# Altium project mobile Basisstation.PrjPcb
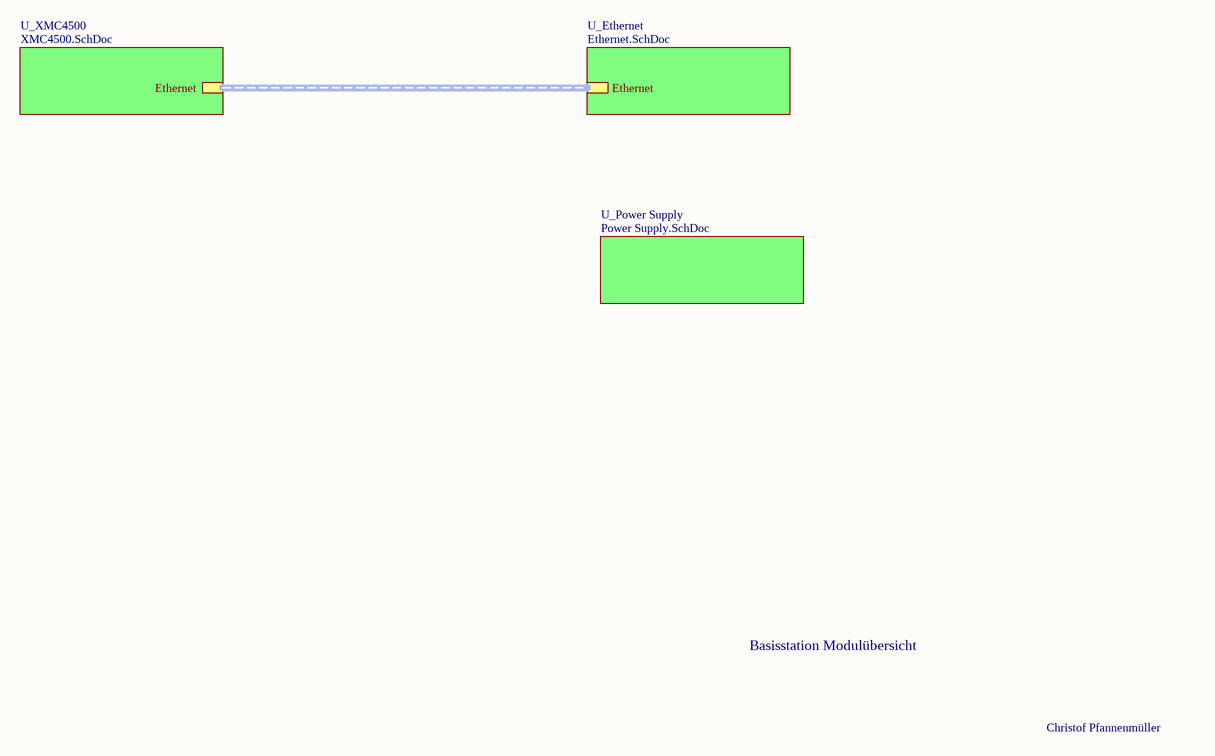
[diagram p0: Basisstation.SchDoc]
5 sheets, 215 parts. Net scope: hierarchical (ports join the sheet entries above them; power ports are global).
Board file: PCB_Testplatine.PcbDoc
Sheets:
  Basisstation.SchDoc
    U_Power Supply = Power Supply.SchDoc
    U_XMC4500 = XMC4500.SchDoc
      TDA1 = TDA5340.SchDoc
      TDA2 = TDA5340.SchDoc
      TDA3 = TDA5340.SchDoc
      TDA4 = TDA5340.SchDoc
      TDA5 = TDA5340.SchDoc
      TDA6 = TDA5340.SchDoc
    U_Ethernet = Ethernet.SchDoc

## Sheet Basisstation.SchDoc
size A4

### Sub-sheets
U_Ethernet = Ethernet.SchDoc: Ethernet (harness Ethernet)
U_Power Supply = Power Supply.SchDoc: no entries
U_XMC4500 = XMC4500.SchDoc: Ethernet (harness Ethernet)

### Buses and harness runs
harness sheet U_Ethernet/Ethernet = sheet U_XMC4500/Ethernet

### Notes on the sheet
- Basisstation Modulübersicht
- Christof Pfannenmüller

## Sheet Power Supply.SchDoc
size A4
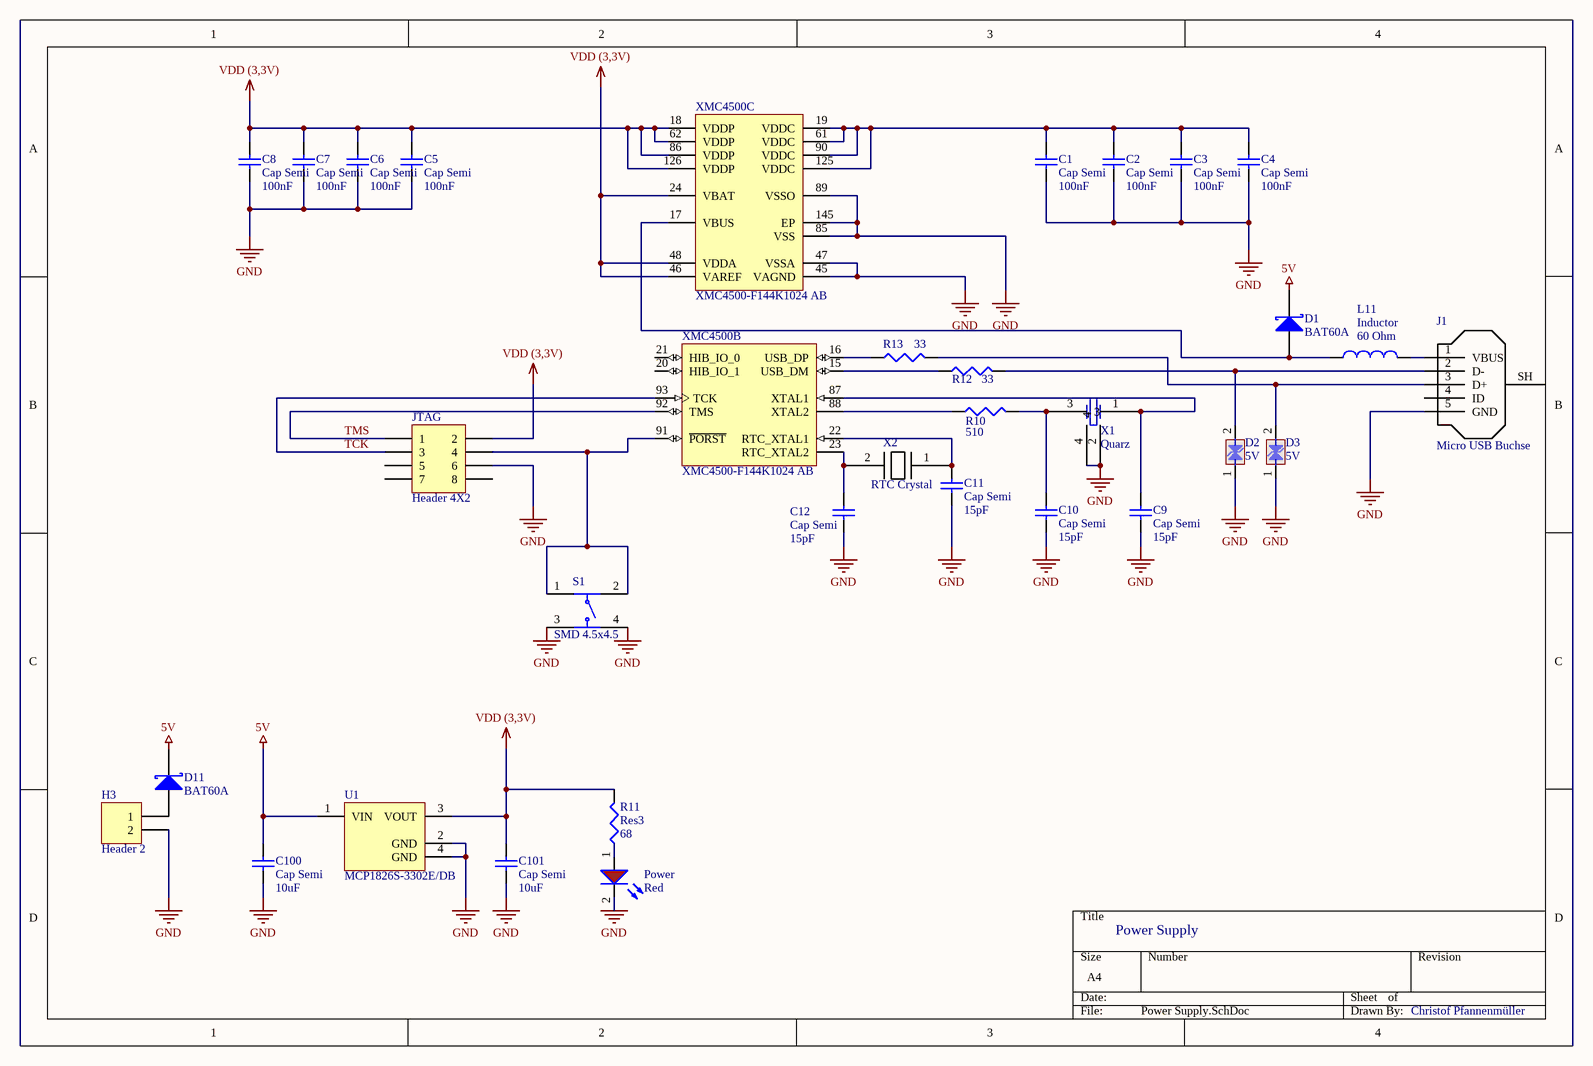
[diagram p1: Power Supply.SchDoc]

### Parts
C1  Cap Semi  value 100nF  [0402]
C2  Cap Semi  value 100nF  [0402]
C3  Cap Semi  value 100nF  [0402]
C4  Cap Semi  value 100nF  [0402]
C5  Cap Semi  value 100nF  [0402]
C6  Cap Semi  value 100nF  [0402]
C7  Cap Semi  value 100nF  [0402]
C8  Cap Semi  value 100nF  [0402]
C9  Cap Semi  value 15pF  [0402]
C10  Cap Semi  value 15pF  [0402]
C11  Cap Semi  value 15pF  [0402]
C12  Cap Semi  value 15pF  [0402]
C100  Cap Semi  value 10uF  [C1206]
C101  Cap Semi  value 10uF  [C1206]
D1  BAT60A  [SOD-323]
D2  5V  [WE-VE_0603]
D3  5V  [WE-VE_0603]
D11  BAT60A  [SOD-323]
H3  Header 2  [HDR1X2]
J1  Micro USB Buchse  [Micro USB Buchse - Molex]
JTAG  Header 4X2  [HDR2X4]
L11  Inductor  value 60 Ohm  [0603]
Power  Red  [LED_0805_Red]
R10  value 510  [J1-0603]  (hidden comment: Res3)
R11  Res3  value 68  [J1-0603]
R12  value 33  [J1-0603]  (hidden comment: Res3)
R13  value 33  [J1-0603]  (hidden comment: Res3)
S1  SMD 4.5x4.5  [430181038816]
U1  MCP1826S-3302E/DB  [SOT-223-DB3_N]
X1  Quarz  [Quarz]
X2  RTC Crystal  [RTC Uhrenquarz  1.5x3.2 SMD]
XMC4500  XMC4500-F144K1024 AB  [INF-PG-LQFP-144-18-6500X6500TP_N]  (parts B,C of 3)

### Nets
5V: C100.2 D1.1(K) D11.1(K) U1.1(VIN)
GND: C1.1 C2.1 C3.1 C4.1 C5.1 C6.1 C7.1 C8.1 C9.1 C10.1 C11.1 C12.1 C100.1 C101.1 D2.1(I/O1) D3.1(I/O1) H3.2 J1.5(GND) JTAG.6 Power.2(C) S1.3 S1.4 U1.2(GND) U1.4(GND) X1.2 X1.4 XMC4500.45(VAGND) XMC4500.47(VSSA) XMC4500.85(VSS) XMC4500.89(VSSO) XMC4500.145(EP)
VDD (3,3V): C5.2 C6.2 C7.2 C8.2 C101.2 JTAG.2 R11.2 U1.3(VOUT) XMC4500.18(VDDP) XMC4500.24(VBAT) XMC4500.46(VAREF) XMC4500.48(VDDA) XMC4500.62(VDDP) XMC4500.86(VDDP) XMC4500.126(VDDP)
TCK: JTAG.3 XMC4500.93(TCK)
TMS: JTAG.1 XMC4500.92(TMS)
NetC1_2: C1.2 C2.2 C3.2 C4.2 XMC4500.19(VDDC) XMC4500.61(VDDC) XMC4500.90(VDDC) XMC4500.125(VDDC)
NetC9_2: C9.2 X1.1 XMC4500.87(XTAL1)
NetC10_2: C10.2 R10.2 X1.3
NetC11_2: C11.2 X2.1 XMC4500.22(RTC_XTAL1)
NetC12_2: C12.2 X2.2 XMC4500.23(RTC_XTAL2)
NetD1_2: D1.2(A) L11.1 XMC4500.17(VBUS)
NetD2_2: D2.2(I/O2) J1.2(D-) R12.2
NetD3_2: D3.2(I/O2) J1.3(D+) R13.2
NetD11_2: D11.2(A) H3.1
NetJ1_1: J1.1(VBUS) L11.2
NetJTAG_4: JTAG.4 S1.1 S1.2 XMC4500.91(~{PORST})
NetPower_1: Power.1(A) R11.1
NetR10_1: R10.1 XMC4500.88(XTAL2)
NetR12_1: R12.1 XMC4500.15(USB_DM)
NetR13_1: R13.1 XMC4500.16(USB_DP)

Not connected (* = marked no-connect by the designer): J1 4(ID) SH; JTAG 5 7 8; XMC4500 20(HIB_IO_1) 21(HIB_IO_0)

### Notes on the sheet
- Power Supply
- Christof Pfannenmüller

### Library data of the parts
C1-C12 C100 C101 = Cap Semi: Capacitor (Semiconductor SIM Model); Published: 8-Jun-2000; LatestRevisionDate: 29-May-2009; LatestRevisionNote: IPC-7351 Footprint Added.; Publisher: Altium Limited; PackageDescription: Chip Capacitor
  C1-C12: PackageReference: C0402
  C100 C101: PackageReference: C1206
D1 D11 = BAT60A: Silicon AF Schottky Rectifier Diode with Extreme Low VF Drop; Published: 21-Mar-2003; LatestRevisionDate: 19-Mar-2004; LatestRevisionNote: Silkscreen size reduced.; DatasheetDocument: Jan-1999; PackageDocument: Sep-2000; PackageReference: SOD-323; Publisher: Altium Limited; ComponentLink1Description: Manufacturer Link; ComponentLink1URL: http://www.infineon.com/; ComponentLink2Description: Datasheet; ComponentLink2URL: http://www.infineon.com/upload/Document/cmc_upload/documents/081/715/bat60aseries_1.pdf
D2 D3 = WE-VE 0603, 82356050560: WE-VE ESD Suppressor, 0603, VDC=5V; Manufacturer: Wurth Elektronik; VDC: 5V; PartNo: 82356050560; ComponentLink1Description: Manufacturer; ComponentLink1URL: http://www.we-online.de; Created by: BJ.Chen; Created Date: Jan 2016; ComponentLink2Description: Datasheet; ComponentLink2URL: http://katalog.we-online.de/pbs/datasheet/82356050560.pdf
H3 = Header 2: Header, 2-Pin; LatestRevisionDate: 17-Jul-2002; LatestRevisionNote: Re-released for DXP Platform.; Publisher: Altium Limited
J1 = Micro USB Buchse - Molex
JTAG = Header 4X2: Header, 4-Pin, Dual row; LatestRevisionDate: 17-Jul-2002; LatestRevisionNote: Re-released for DXP Platform.; Publisher: Altium Limited
L11 = Inductor: Code_IEC: 1005; Published: 8-Jun-2000; LatestRevisionDate: 29-May-2009; LatestRevisionNote: IPC-7351 Footprint Added.; PackageReference: 0402-A; Publisher: Altium Limited; PackageDescription: Chip Inductor; Code_JEITA: 0402
Power = WL-SMCW 0805  150080RS75000: SMD mono-color Chip LED, WL-SMCW, Red; Manufacturer: W黵th Elektronik eiSos GmbH; PartNo: 150080RS75000; ComponentLink1Description: Manufacturer; ComponentLink1URL: http://www.we-online.de; Created by: Christin Otto; Created Date: June 2013; ComponentLink2Description: Datasheet; ComponentLink2URL: http://katalog.we-online.com/led/datasheet/150080RS75000.pdf; Color: Red
R10-R13 = Res3: Resistor; Published: 8-Jun-2000; LatestRevisionDate: 29-May-2009; LatestRevisionNote: IPC-7351 Footprint Added.; PackageReference: J1-0603; Publisher: Altium Limited; PackageDescription: Chip Resistor
S1 = WS-TASV, 430181038816: WS-TASV 4.5x4.5 mm SMD; Manufacturer: Wurth Elektronik; partNo: 430181038816; ComponentLink1Description: Manufacturer; ComponentLink1URL: http://www.we-online.de; Created by: Baojun Chen; Created Date: Dec.2015; ComponentLink2Description: Datasheet; ComponentLink2URL: http://katalog.we-online.de/em/datasheet/430181038816.pdf; Ausführung: SMD 4.5x4.5
U1 = MCP1826S-3302E/DB: 1000 mA, Low Voltage, Low Quiescent Current LDO Regulator, 3-Pin SOT-223, Extended Temperature; Manufacturer: Microchip; DatasheetVersion: revA, Aug-2007; PackageVersion: revBB, Aug-2009; PackageReference: SOT-223-DB3; PackageDescription: 3-Lead Plastic Small Outline Transistor (DB) [SOT-223]; Supplier 1: Digi-Key; Supplier Part Number 1: MCP1826S-3302E/DB-ND; Supplier 2: Newark; Supplier Part Number 2: 27M0037; Supplier 3: Mouser; Supplier Part Number 3: 579-MCP1826S-3302EDB; Mounting Technology: Surface Mount; PartNumber: MCP1826S-3302E/DB; ComponentLink1Description: Manufacturer URL; ComponentLink1URL: http://www.microchip.com/; ComponentLink2Description: Datasheet; ComponentLink2URL: http://ww1.microchip.com/downloads/en/DeviceDoc/22057a.pdf; ComponentLink3Description: Package Specification; ComponentLink3URL: http://www.microchip.com/stellent/groups/techpub_sg/documents/packagingspec/en012702.pdf
XMC4500 = XMC4500-F144K1024 AB: 120 MHz XMC4500 MCU with 1,024 KByte Program Memory, 160 KByte SRAM, 3.3 V, -40 to 125 degC, PG-LQFP-144, Green; Manufacturer: Infineon; A / D input lines (incl. FADC): 26; Digital I/O Lines: 91; Program Memory: 1,024.0 KByte; SRAM (incl. Cache): 160.0 KByte; Type of Serial I/O Interfaces: 6xSPI, Dual SPI, Quad SPI, UART, LIN, IIC, IIS; DatasheetVersion: V1.0; PackageVersion: V1.0; PackageReference: PG-LQFP-144-18; PackageDescription: 144-Pin Plastic (Green) Low Profile Quad Flat Package, 20 x 20 mm Body, 0.5 mm Pitch; Halogen-free: TRUE; Mounting Technology: Surface Mount; PartNumber: XMC4500-F144K1024 AB; ComponentLink1Description: Manufacturer URL; ComponentLink1URL: http://www.infineon.com; ComponentLink2Description: Datasheet; ComponentLink2URL: http://www.infineon.com/dgdl/xmc4500_ds_v1+0_2013_01.pdf?folderId=db3a30433580b3710135a47f3eb76c98&fileId=db3a304335b504400135bdca7ed86742&location=en.Products.Microcontrollers.32-bit_Industrial_Microcontrollers_based_on_ARM__Cortex_-M.32-bit_XMC4000_Industrial_Microcontrollers_ARM__Cortex_-M4.DATASHEET.xmc4500_ds_v1 0_2013_01.pdf; ComponentLink3Description: Package Specification; ComponentLink3URL: http://www.infineon.com/cms/packages/SMD_-_Surface_Mounted_Devices/P-PG-LQFP/P-PG-LQFP-144-04x_13x_14x_15x_16x_18.html?__locale=en

## Sheet XMC4500.SchDoc
size A4
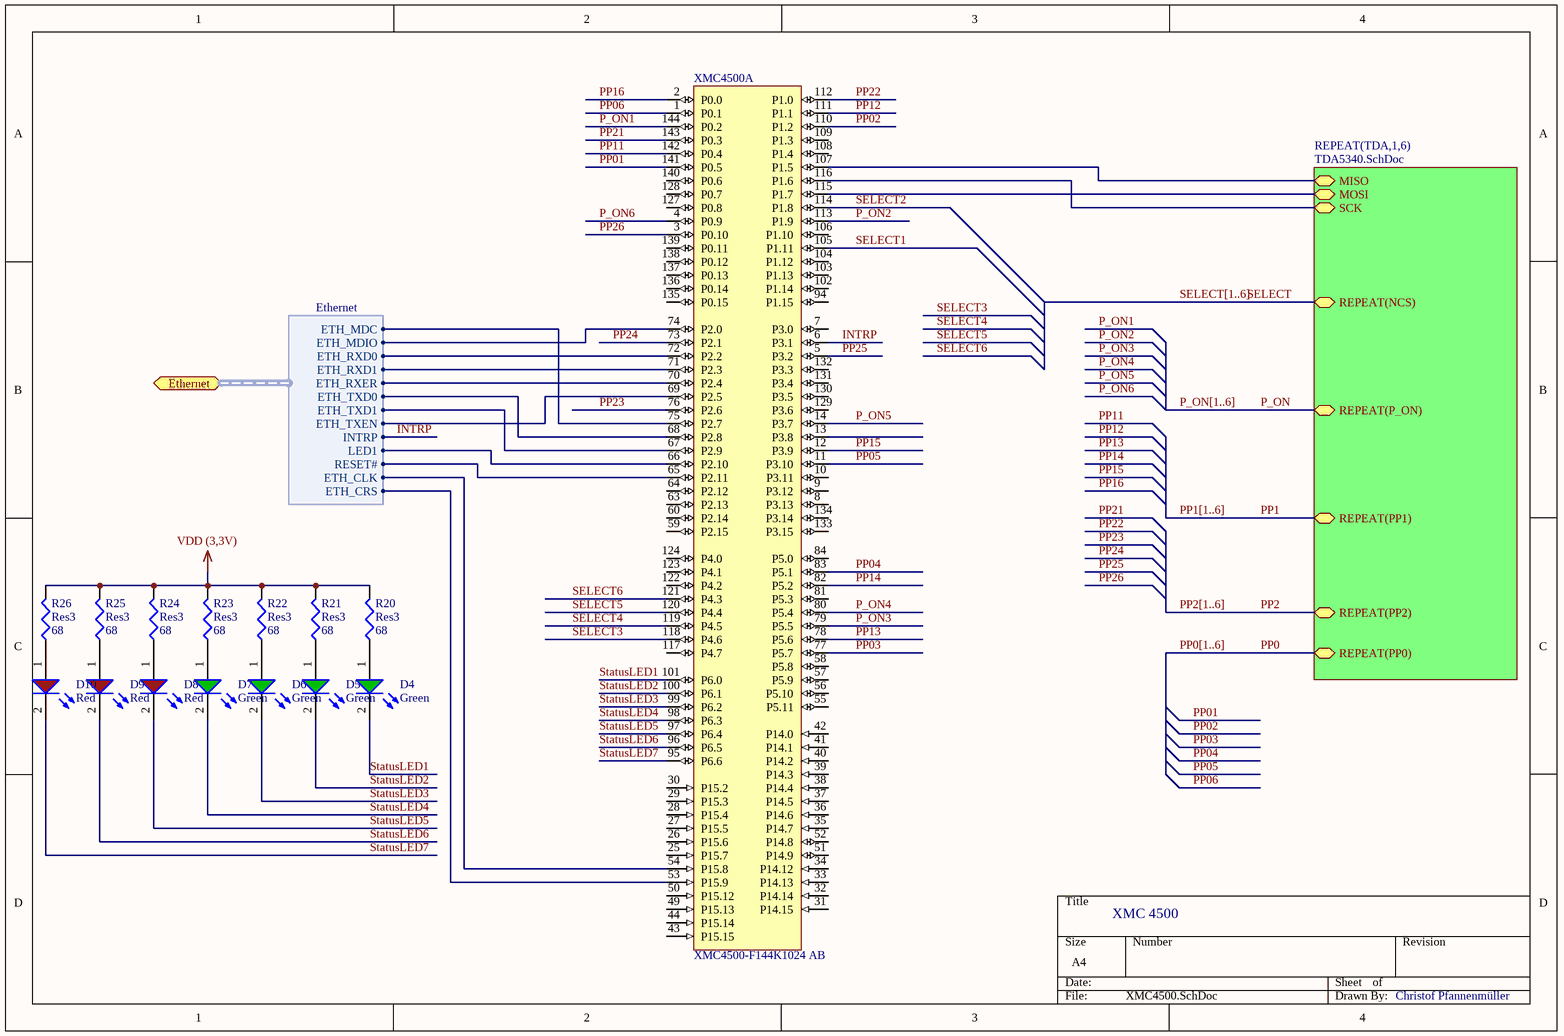
[diagram p2: XMC4500.SchDoc]

### Parts
D4  Green  [LED_0805_Green]
D5  Green  [LED_0805_Green]
D6  Green  [LED_0805_Green]
D7  Green  [LED_0805_Green]
D8  Red  [LED_0805_Red]
D9  Red  [LED_0805_Red]
D10  Red  [LED_0805_Red]
R20  Res3  value 68  [J1-0603]
R21  Res3  value 68  [J1-0603]
R22  Res3  value 68  [J1-0603]
R23  Res3  value 68  [J1-0603]
R24  Res3  value 68  [J1-0603]
R25  Res3  value 68  [J1-0603]
R26  Res3  value 68  [J1-0603]
XMC4500  XMC4500-F144K1024 AB  [INF-PG-LQFP-144-18-6500X6500TP_N]  (part A of 3)

### Sub-sheets
REPEAT(TDA,1,6) = TDA5340.SchDoc: MISO, MOSI, REPEAT(NCS), REPEAT(P_ON), REPEAT(PP2), SCK, REPEAT(PP0), REPEAT(PP1)

### Ports
Ethernet (harness Ethernet)

### Harnesses
Ethernet: ETH_CLK, ETH_CRS, ETH_MDC, ETH_MDIO, ETH_RXD0, ETH_RXD1, ETH_RXER, ETH_TXD0, ETH_TXD1, ETH_TXEN, INTRP, LED1, RESET#

### Nets
VDD (3,3V): R20.2 R21.2 R22.2 R23.2 R24.2 R25.2 R26.2
INTRP: XMC4500.6(P3.1) ; port Ethernet.INTRP
LED1: XMC4500.66(P2.10) ; port Ethernet.LED1
MISO: XMC4500.107(P1.5) ; sheet REPEAT(TDA,1,6)/MISO
MOSI: XMC4500.115(P1.7) ; sheet REPEAT(TDA,1,6)/MOSI
P_ON: sheet REPEAT(TDA,1,6)/REPEAT(P_ON)
P_ON1: XMC4500.144(P0.2)  [project net P_ON]
P_ON2: XMC4500.113(P1.9)  [project net P_ON]
P_ON3: XMC4500.79(P5.5)  [project net P_ON]
P_ON4: XMC4500.80(P5.4)  [project net P_ON]
P_ON5: XMC4500.14(P3.7)  [project net P_ON]
P_ON6: XMC4500.4(P0.9)  [project net P_ON]
PP0: sheet REPEAT(TDA,1,6)/REPEAT(PP0)
PP01: XMC4500.141(P0.5)  [project net PP0]
PP1: sheet REPEAT(TDA,1,6)/REPEAT(PP1)
PP02: XMC4500.110(P1.2)  [project net PP0]
PP2: sheet REPEAT(TDA,1,6)/REPEAT(PP2)
PP03: XMC4500.77(P5.7)  [project net PP0]
PP04: XMC4500.83(P5.1)  [project net PP0]
PP05: XMC4500.11(P3.10)  [project net PP0]
PP06: XMC4500.1(P0.1)  [project net PP0]
PP11: XMC4500.142(P0.4)  [project net PP1]
PP12: XMC4500.111(P1.1)  [project net PP1]
PP13: XMC4500.78(P5.6)  [project net PP1]
PP14: XMC4500.82(P5.2)  [project net PP1]
PP15: XMC4500.12(P3.9)  [project net PP1]
PP16: XMC4500.2(P0.0)  [project net PP1]
PP21: XMC4500.143(P0.3)  [project net PP2]
PP22: XMC4500.112(P1.0)  [project net PP2]
PP23: XMC4500.76(P2.6)  [project net PP2]
PP24: XMC4500.73(P2.1)  [project net PP2]
PP25: XMC4500.5(P3.2)  [project net PP2]
PP26: XMC4500.3(P0.10)  [project net PP2]
RESET#: XMC4500.65(P2.11) ; port Ethernet.RESET#
SCK: XMC4500.116(P1.6) ; sheet REPEAT(TDA,1,6)/SCK
SELECT: sheet REPEAT(TDA,1,6)/REPEAT(NCS)
SELECT1: XMC4500.105(P1.11)  [project net NCS]
SELECT2: XMC4500.114(P1.8)  [project net NCS]
SELECT3: XMC4500.118(P4.6)  [project net NCS]
SELECT4: XMC4500.119(P4.5)  [project net NCS]
SELECT5: XMC4500.120(P4.4)  [project net NCS]
SELECT6: XMC4500.121(P4.3)  [project net NCS]
StatusLED1: D4.2(C) XMC4500.101(P6.0)
StatusLED2: D5.2(C) XMC4500.100(P6.1)
StatusLED3: D6.2(C) XMC4500.99(P6.2)
StatusLED4: D7.2(C) XMC4500.98(P6.3)
StatusLED5: D8.2(C) XMC4500.97(P6.4)
StatusLED6: D9.2(C) XMC4500.96(P6.5)
StatusLED7: D10.2(C) XMC4500.95(P6.6)
NetD4_1: D4.1(A) R20.1
NetD5_1: D5.1(A) R21.1
NetD6_1: D6.1(A) R22.1
NetD7_1: D7.1(A) R23.1
NetD8_1: D8.1(A) R24.1
NetD9_1: D9.1(A) R25.1
NetD10_1: D10.1(A) R26.1
NetIC3_10: XMC4500.74(P2.0) ; port Ethernet.ETH_MDIO
NetIC3_11: XMC4500.75(P2.7) ; port Ethernet.ETH_MDC
NetIC3_12: XMC4500.71(P2.3) ; port Ethernet.ETH_RXD1
NetIC3_13: XMC4500.72(P2.2) ; port Ethernet.ETH_RXD0
NetIC3_15: XMC4500.53(P15.9) ; port Ethernet.ETH_CRS
NetIC3_16: XMC4500.54(P15.8) ; port Ethernet.ETH_CLK
NetIC3_17: XMC4500.70(P2.4) ; port Ethernet.ETH_RXER
NetIC3_19: XMC4500.69(P2.5) ; port Ethernet.ETH_TXEN
NetIC3_20: XMC4500.68(P2.8) ; port Ethernet.ETH_TXD0
NetIC3_21: XMC4500.67(P2.9) ; port Ethernet.ETH_TXD1

Not connected (* = marked no-connect by the designer): XMC4500 7(P3.0) 8(P3.13) 9(P3.12) 10(P3.11) 13(P3.8) 25(P15.7) 26(P15.6) 27(P15.5) 28(P15.4) 29(P15.3) 30(P15.2) 31(P14.15) 32(P14.14) 33(P14.13) 34(P14.12) 35(P14.7) 36(P14.6) 37(P14.5) 38(P14.4) 39(P14.3) 40(P14.2) 41(P14.1) 42(P14.0) 43(P15.15) 44(P15.14) 49(P15.13) 50(P15.12) 51(P14.9) 52(P14.8) 55(P5.11) 56(P5.10) 57(P5.9) 58(P5.8) 59(P2.15) 60(P2.14) 63(P2.13) 64(P2.12) 81(P5.3) 84(P5.0) 94(P1.15) 102(P1.14) 103(P1.13) 104(P1.12) 106(P1.10) 108(P1.4) 109(P1.3) 117(P4.7) 122(P4.2) 123(P4.1) 124(P4.0) 127(P0.8) 128(P0.7) 129(P3.6) 130(P3.5) 131(P3.4) 132(P3.3) 133(P3.15) 134(P3.14) 135(P0.15) 136(P0.14) 137(P0.13) 138(P0.12) 139(P0.11) 140(P0.6)

### Buses and harness runs
bus P_ON[1..6]
bus PP0[1..6]
bus PP1[1..6]
bus PP2[1..6]
bus SELECT[1..6]

### Notes on the sheet
- XMC 4500
- Christof Pfannenmüller

### Library data of the parts
D4-D7 = WL-SMCW 0805  150080GS75000: SMD mono-color Chip LED, WL-SMCW, Green; Manufacturer: W黵th Elektronik eiSos GmbH; PartNo: 150080GS75000; ComponentLink1Description: Manufacturer; ComponentLink1URL: http://www.we-online.de; Created by: Christin Otto; Created Date: June 2013; ComponentLink2Description: Datasheet; ComponentLink2URL: http://katalog.we-online.com/led/datasheet/150080GS75000.pdf; Color: Green
D8-D10 = WL-SMCW 0805  150080RS75000: as Power on sheet Power Supply; PartNo: 150080RS75000; ComponentLink1Description: Manufacturer; ComponentLink1URL: http://www.we-online.de; Created by: Christin Otto; Created Date: June 2013; ComponentLink2Description: Datasheet; ComponentLink2URL: http://katalog.we-online.com/led/datasheet/150080RS75000.pdf; Color: Red
R20-R26 = Res3: Resistor; Published: 8-Jun-2000; LatestRevisionDate: 29-May-2009; LatestRevisionNote: IPC-7351 Footprint Added.; PackageReference: J1-0603; Publisher: Altium Limited; PackageDescription: Chip Resistor
XMC4500 = XMC4500-F144K1024 AB: as XMC4500 on sheet Power Supply; DatasheetVersion: V1.0; PackageVersion: V1.0; PackageReference: PG-LQFP-144-18; PackageDescription: 144-Pin Plastic (Green) Low Profile Quad Flat Package, 20 x 20 mm Body, 0.5 mm Pitch; Halogen-free: TRUE; Mounting Technology: Surface Mount; PartNumber: XMC4500-F144K1024 AB; ComponentLink1Description: Manufacturer URL; ComponentLink1URL: http://www.infineon.com; ComponentLink2Description: Datasheet; ComponentLink2URL: http://www.infineon.com/dgdl/xmc4500_ds_v1+0_2013_01.pdf?folderId=db3a30433580b3710135a47f3eb76c98&fileId=db3a304335b504400135bdca7ed86742&location=en.Products.Microcontrollers.32-bit_Industrial_Microcontrollers_based_on_ARM__Cortex_-M.32-bit_XMC4000_Industrial_Microcontrollers_ARM__Cortex_-M4.DATASHEET.xmc4500_ds_v1 0_2013_01.pdf; ComponentLink3Description: Package Specification; ComponentLink3URL: http://www.infineon.com/cms/packages/SMD_-_Surface_Mounted_Devices/P-PG-LQFP/P-PG-LQFP-144-04x_13x_14x_15x_16x_18.html?__locale=en

## Sheet TDA5340.SchDoc
size A4
Used 6 times, as channels U_XMC4500/TDA1, U_XMC4500/TDA2, U_XMC4500/TDA3, U_XMC4500/TDA4, U_XMC4500/TDA5, U_XMC4500/TDA6. Parts and nets are listed once, with the designators drawn on the sheet.
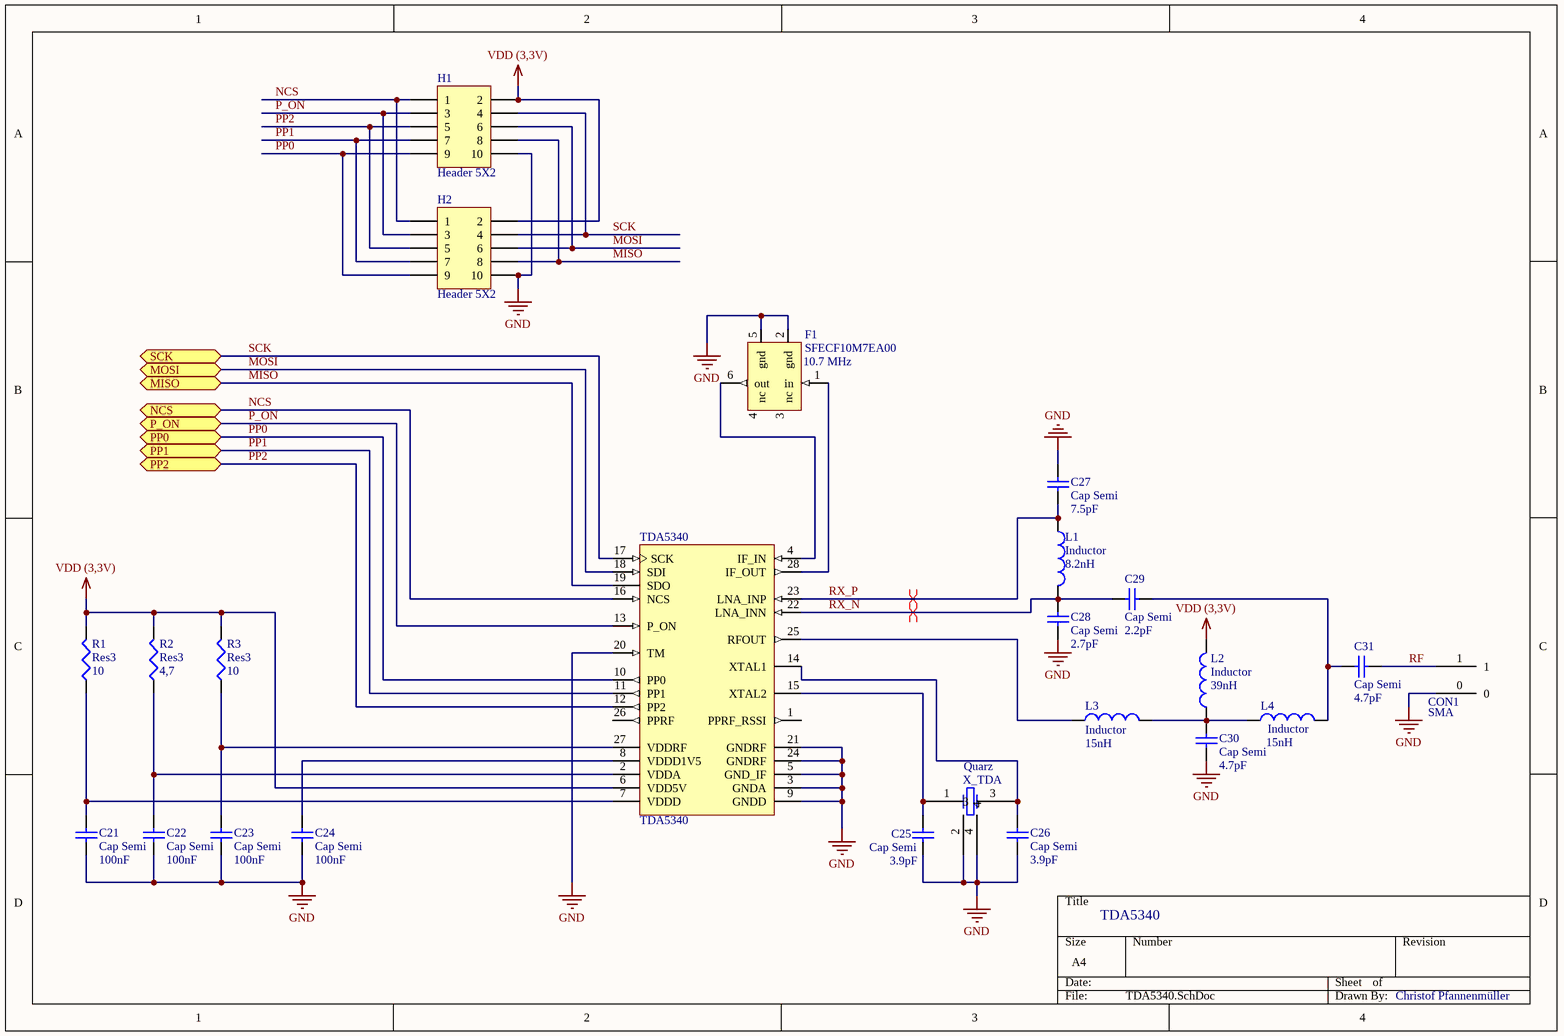
[diagram p3: TDA5340.SchDoc]

### Parts
C21  Cap Semi  value 100nF  [0402]
C22  Cap Semi  value 100nF  [0402]
C23  Cap Semi  value 100nF  [0402]
C24  Cap Semi  value 100nF  [0402]
C25  Cap Semi  value 3.9pF  [0402]
C26  Cap Semi  value 3.9pF  [0402]
C27  Cap Semi  value 7.5pF  [0402]
C28  Cap Semi  value 2.7pF  [0402]
C29  Cap Semi  value 2.2pF  [0402]
C30  Cap Semi  value 4.7pF  [0402]
C31  Cap Semi  value 4.7pF  [0402]
CON1  SMA  [SMA]
F1  SFECF10M7EA00  Frequenz: 10.7 MHz  [SOP6]
H1  Header 5X2  [HDR2X5]
H2  Header 5X2  [HDR2X5]
L1  Inductor  value 8.2nH  [INDC1608L]
L2  Inductor  value 39nH  [INDC1608L]
L3  Inductor  value 15nH  [INDC1608L]
L4  Inductor  value 15nH  [INDC1608L]
R1  Res3  value 10  [J1-0603]
R2  Res3  value 4,7  [J1-0603]
R3  Res3  value 10  [J1-0603]
TDA5340  TDA5340  [INF-PG-TSSOP-28_N]
X_TDA  Quarz  [Quarz]

### Ports
MISO, MOSI, NCS, P_ON, PP0, PP1, PP2, SCK

### Nets
GND: C21.2 C22.2 C23.2 C24.2 C25.2 C26.1 C27.1 C28.2 C30.1 CON1.0 F1.2(gnd) F1.5(gnd) H1.10 H2.10 TDA5340.3(GNDA) TDA5340.5(GND_IF) TDA5340.9(GNDD) TDA5340.20(TM) TDA5340.21(GNDRF) TDA5340.24(GNDRF) X_TDA.2 X_TDA.4
VDD (3,3V): H1.2 H2.2 L2.2 R1.2 R2.2 R3.2 TDA5340.6(VDD5V)
MISO: H1.8 H2.8 TDA5340.19(SDO) ; port MISO
MOSI: H1.6 H2.6 TDA5340.18(SDI) ; port MOSI
NCS: H1.1 H2.1 TDA5340.16(NCS) ; port NCS
P_ON: H1.3 H2.3 TDA5340.13(P_ON) ; port P_ON
PP0: H1.9 H2.9 TDA5340.10(PP0) ; port PP0
PP1: H1.7 H2.7 TDA5340.11(PP1) ; port PP1
PP2: H1.5 H2.5 TDA5340.12(PP2) ; port PP2
RF: C31.2 CON1.1
RX_N: C28.1 C29.2 L1.2 TDA5340.22(LNA_INN)
RX_P: C27.2 L1.1 TDA5340.23(LNA_INP)
SCK: H1.4 H2.4 TDA5340.17(SCK) ; port SCK
NetC21_1: C21.1 R1.1 TDA5340.7(VDDD)
NetC22_1: C22.1 R2.1 TDA5340.2(VDDA)
NetC23_1: C23.1 R3.1 TDA5340.27(VDDRF)
NetC24_1: C24.1 TDA5340.8(VDDD1V5)
NetC25_1: C25.1 TDA5340.15(XTAL2) X_TDA.1
NetC26_2: C26.2 TDA5340.14(XTAL1) X_TDA.3
NetC29_1: C29.1 C31.1 L4.2
NetC30_2: C30.2 L2.1 L3.2 L4.1
NetF1_1: F1.1(in) TDA5340.28(IF_OUT)
NetF1_6: F1.6(out) TDA5340.4(IF_IN)
NetL3_1: L3.1 TDA5340.25(RFOUT)

Not connected (* = marked no-connect by the designer): F1 3(nc) 4(nc); TDA5340 1(PPRF_RSSI) 26(PPRF)

### Channels
U_XMC4500/TDA1: designators end in _TDA1; ports MISO=MISO MOSI=MOSI NCS=NCS P_ON=P_ON PP0=PP0 PP1=PP1 PP2=PP2 SCK=SCK
U_XMC4500/TDA2: designators end in _TDA2; ports MISO=MISO MOSI=MOSI NCS=NCS P_ON=P_ON PP0=PP0 PP1=PP1 PP2=PP2 SCK=SCK
U_XMC4500/TDA3: designators end in _TDA3; ports MISO=MISO MOSI=MOSI NCS=NCS P_ON=P_ON PP0=PP0 PP1=PP1 PP2=PP2 SCK=SCK
U_XMC4500/TDA4: designators end in _TDA4; ports MISO=MISO MOSI=MOSI NCS=NCS P_ON=P_ON PP0=PP0 PP1=PP1 PP2=PP2 SCK=SCK
U_XMC4500/TDA5: designators end in _TDA5; ports MISO=MISO MOSI=MOSI NCS=NCS P_ON=P_ON PP0=PP0 PP1=PP1 PP2=PP2 SCK=SCK
U_XMC4500/TDA6: designators end in _TDA6; ports MISO=MISO MOSI=MOSI NCS=NCS P_ON=P_ON PP0=PP0 PP1=PP1 PP2=PP2 SCK=SCK

### Layout directives
differential pair: RX_N_TDA1, RX_P_TDA1

### Notes on the sheet
- TDA5340
- Christof Pfannenmüller

### Library data of the parts
C21-C31 = Cap Semi: Capacitor (Semiconductor SIM Model); Published: 8-Jun-2000; LatestRevisionDate: 29-May-2009; LatestRevisionNote: IPC-7351 Footprint Added.; PackageReference: C0402; Publisher: Altium Limited; PackageDescription: Chip Capacitor
F1 = SFECF10M7EA00: Typ: Ceramic Filter
H1 H2 = Header 5X2: Header, 5-Pin, Dual row; LatestRevisionDate: 17-Jul-2002; LatestRevisionNote: Re-released for DXP Platform.; Publisher: Altium Limited
L1-L4 = Inductor: Code_IEC: 1005; Published: 8-Jun-2000; LatestRevisionDate: 29-May-2009; LatestRevisionNote: IPC-7351 Footprint Added.; PackageReference: 0402-A; Publisher: Altium Limited; PackageDescription: Chip Inductor; Code_JEITA: 0402
R1-R3 = Res3: Resistor; Published: 8-Jun-2000; LatestRevisionDate: 29-May-2009; LatestRevisionNote: IPC-7351 Footprint Added.; PackageReference: J1-0603; Publisher: Altium Limited; PackageDescription: Chip Resistor
TDA5340 = TDA5340: High Sensitivity Multi-Channel Transceiver, -40 to 110 degC, PG-TSSOP-28, Green; Manufacturer: Infineon; Frequency Band: 315 MHz, 434 MHz, 470 MHz, 868 MHz, 915 MHz, 959 MHz; Green: yes; Group: SmartLEWIS TRX to Multi-channel TRX with Digital Baseband Processing; Modulation Type: ASK / FSK / GSFK; Transmit Power (at 3V): 14 dBm; DatasheetVersion: Rev. 1.2; PackageReference: PG-TSSOP-28; PackageDescription: 28-Pin Plastic (Green) Thin Shrink Small Outline Package, 9.7 x 4.4 mm Body, 0.65 mm Pitch; Supplier 1: Mouser; Supplier Part Number 1: N/A; Channel Requirements per Band: Multi-Channel; Halogen-free: yes; Mounting Technology: Surface Mount; PartNumber: TDA5340; ComponentLink1Description: Manufacturer URL; ComponentLink1URL: http://www.infineon.com/; ComponentLink2Description: Datasheet; ComponentLink2URL: http://www.infineon.com/dgdl/TDA5340_DS_V1.2.pdf?folderId=db3a3043191a246301192dd387ea2ae3&fileId=db3a30433408410401340ea9a6a4300a; ComponentLink3Description: Package Specification; ComponentLink3URL: http://www.infineon.com/cms/packages/SMD_-_Surface_Mounted_Devices/P-PG-TSSOP/P-PG-TSSOP-28-1x_-4x_-8.html?__locale=en

## Sheet Ethernet.SchDoc
size A4
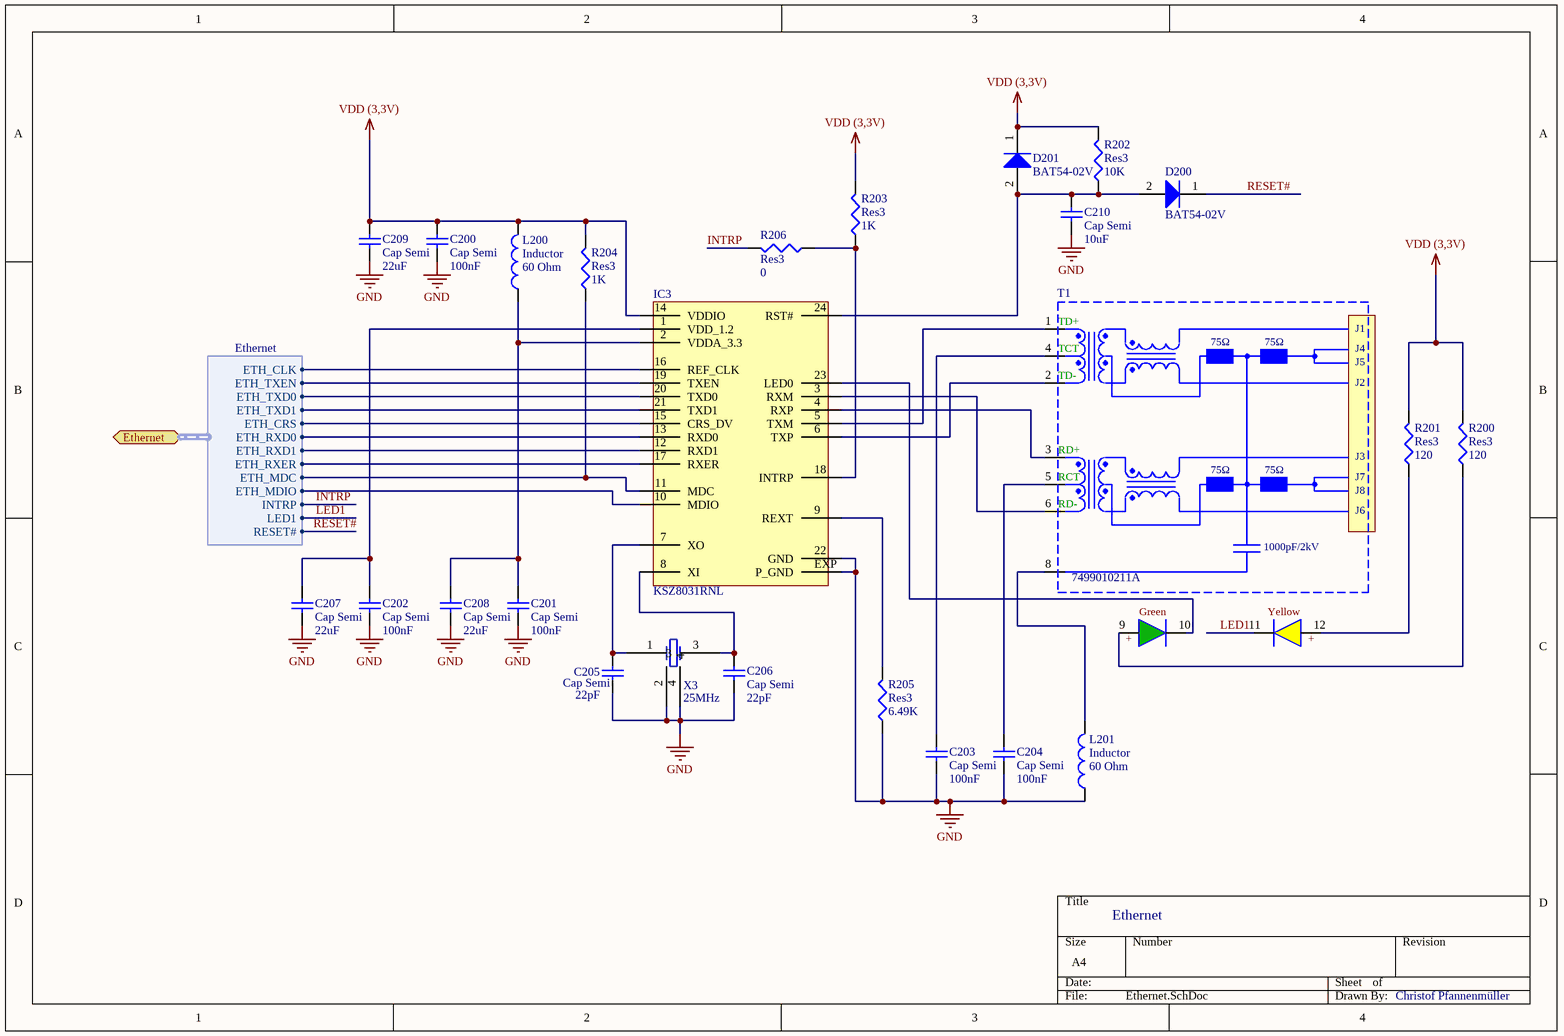
[diagram p4: Ethernet.SchDoc]

### Parts
C200  Cap Semi  value 100nF  [0402]
C201  Cap Semi  value 100nF  [0402]
C202  Cap Semi  value 100nF  [C1206]
C203  Cap Semi  value 100nF  [C1206]
C204  Cap Semi  value 100nF  [C1206]
C205  Cap Semi  value 22pF  [0402]
C206  Cap Semi  value 22pF  [0402]
C207  Cap Semi  value 22uF  [C1206]
C208  Cap Semi  value 22uF  [C1206]
C209  Cap Semi  value 22uF  [C1206]
C210  Cap Semi  value 10uF  [C1206]
D200  BAT54-02V  [INF-SC79_V]
D201  BAT54-02V  [INF-SC79_V]
IC3  KSZ8031RNL  [QFN /MLF 24pin]
L200  Inductor  value 60 Ohm  [0603]
L201  Inductor  value 60 Ohm  [0603]
R200  Res3  value 120  [J1-0603]
R201  Res3  value 120  [J1-0603]
R202  Res3  value 10K  [J1-0603]
R203  Res3  value 1K  [J1-0603]
R204  Res3  value 1K  [J1-0603]
R205  Res3  value 6.49K  [J1-0603]
R206  Res3  value 0  [J1-0603]
T1  7499010211A  [7499010211A]
X3  25MHz  [Quarz]

### Ports
Ethernet (harness Ethernet)

### Harnesses
Ethernet: ETH_CLK, ETH_TXEN, ETH_TXD0, ETH_TXD1, ETH_CRS, ETH_RXD0, ETH_RXD1, ETH_RXER, ETH_MDC, ETH_MDIO, INTRP, LED1, RESET#

### Nets
GND: C200.1 C201.1 C202.1 C203.1 C204.1 C205.1 C206.1 C207.1 C208.1 C209.1 C210.1 IC3.22(GND) IC3.EXP(P_GND) L201.1 R205.1 X3.2 X3.4
VDD (3,3V): C200.2 C209.2 D201.1(K) IC3.14(VDDIO) L200.2 R200.2 R201.2 R202.2 R203.2 R204.2
INTRP: R206.2 ; port Ethernet.INTRP
LED1: T1.11 ; port Ethernet.LED1
RESET#: D200.1(K) ; port Ethernet.RESET#
NetC201_2: C201.2 C208.2 IC3.2(VDDA_3.3) L200.1
NetC202_2: C202.2 C207.2 IC3.1(VDD_1.2)
NetC203_2: C203.2 T1.4(RD+)
NetC204_2: C204.2 T1.5(RCT)
NetC205_2: C205.2 IC3.7(XO) X3.1
NetC206_2: C206.2 IC3.8(XI) X3.3
NetC210_2: C210.2 D200.2(A) D201.2(A) IC3.24(RST#) R202.1
NetIC3_3: IC3.3(RXM) T1.6(RD-)
NetIC3_4: IC3.4(RXP) T1.3(TD-)
NetIC3_5: IC3.5(TXM) T1.1(TD+)
NetIC3_6: IC3.6(TXP) T1.2(TCT)
NetIC3_9: IC3.9(REXT) R205.2
NetIC3_10: IC3.10(MDIO) ; port Ethernet.ETH_MDIO
NetIC3_11: IC3.11(MDC) R204.1 ; port Ethernet.ETH_MDC
NetIC3_12: IC3.12(RXD1) ; port Ethernet.ETH_RXD1
NetIC3_13: IC3.13(RXD0) ; port Ethernet.ETH_RXD0
NetIC3_15: IC3.15(CRS_DV) ; port Ethernet.ETH_CRS
NetIC3_16: IC3.16(REF_CLK) ; port Ethernet.ETH_CLK
NetIC3_17: IC3.17(RXER) ; port Ethernet.ETH_RXER
NetIC3_18: IC3.18(INTRP) R203.1 R206.1
NetIC3_19: IC3.19(TXEN) ; port Ethernet.ETH_TXEN
NetIC3_20: IC3.20(TXD0) ; port Ethernet.ETH_TXD0
NetIC3_21: IC3.21(TXD1) ; port Ethernet.ETH_TXD1
NetIC3_23: IC3.23(LED0) T1.10
NetL201_2: L201.2 T1.8
NetR200_1: R200.1 T1.9
NetR201_1: R201.1 T1.12

### Notes on the sheet
- Ethernet
- Christof Pfannenmüller
- (in symbol 7499010211A) J1; 75Ω; J4; J5; J2; J3; J7; J8; J6; 1000pF/2kV; Green; Yellow; +

### Library data of the parts
C200-C210 = Cap Semi: Capacitor (Semiconductor SIM Model); Published: 8-Jun-2000; LatestRevisionDate: 29-May-2009; LatestRevisionNote: IPC-7351 Footprint Added.; PackageReference: C1206; Publisher: Altium Limited; PackageDescription: Chip Capacitor
D200 D201 = BAT54-02V: Silicon Schottky Diode, SC79, Reel, Green; Manufacturer: Infineon; Green: TRUE; PackageReference: SC79; PackageDescription: 2-Pin Semiconductor Package, 0.8 x 1.2 mm Body; Supplier 1: Mouser; Supplier Part Number 1: N/A; Halogen-free: FALSE; Mounting Technology: Surface Mount; PartNumber: BAT54-02V; ComponentLink1Description: Manufacturer URL; ComponentLink1URL: http://www.infineon.com/; ComponentLink2Description: Datasheet; ComponentLink2URL: http://www.infineon.com/dgdl/bat54series.pdf?folderId=db3a30431400ef68011425f1ca2505e3&fileId=db3a304314dca3890115190b74210ea6; ComponentLink3Description: Package Specification; ComponentLink3URL: http://www.infineon.com/dgdl/SC79-Package_Overview.pdf?folderId=db3a30431936bc4b011951fbddb03b15&fileId=db3a30431936bc4b01195226fe583b41
L200 L201 = Inductor: Code_IEC: 1005; Published: 8-Jun-2000; LatestRevisionDate: 29-May-2009; LatestRevisionNote: IPC-7351 Footprint Added.; PackageReference: 0402-A; Publisher: Altium Limited; PackageDescription: Chip Inductor; Code_JEITA: 0402
R200-R206 = Res3: Resistor; Published: 8-Jun-2000; LatestRevisionDate: 29-May-2009; LatestRevisionNote: IPC-7351 Footprint Added.; PackageReference: J1-0603; Publisher: Altium Limited; PackageDescription: Chip Resistor
T1 = 7499010211A: RJ45 LAN Transformer, 10/100 Base-T; Manufacturer: Wurth Elektronik; ComponentLink1 Description: Manufacturer; ComponentLink2 Description: Datasheet; ComponentLink1 URL: http://www.we-online.com; ComponentLink2 URL: http://katalog.we-online.de/pbs/datasheet/7499010211A.pdf; Created By: Baojun Chen; Created Date: 14-Aug-15; PartNo: 7499010211A
X3 = Quarz: Value: 25MHz

## Nets that join several sheets
GND: Power Supply (31 pins), U_XMC4500/TDA1 (22 pins), U_XMC4500/TDA2 (22 pins), U_XMC4500/TDA3 (22 pins), U_XMC4500/TDA4 (22 pins), U_XMC4500/TDA5 (22 pins), U_XMC4500/TDA6 (22 pins), Ethernet (17 pins)
VDD (3,3V): Power Supply (15 pins), XMC4500 (7 pins), U_XMC4500/TDA1 (7 pins), U_XMC4500/TDA2 (7 pins), U_XMC4500/TDA3 (7 pins), U_XMC4500/TDA4 (7 pins), U_XMC4500/TDA5 (7 pins), U_XMC4500/TDA6 (7 pins), Ethernet (10 pins)
INTRP: XMC4500 (XMC4500.6), Ethernet (R206.2)
LED1: XMC4500 (XMC4500.66), Ethernet (T1.11)
MISO: XMC4500 (XMC4500.107), U_XMC4500/TDA1 (H1_TDA1.8 H2_TDA1.8 TDA5340_TDA1.19), U_XMC4500/TDA2 (H1_TDA2.8 H2_TDA2.8 TDA5340_TDA2.19), U_XMC4500/TDA3 (H1_TDA3.8 H2_TDA3.8 TDA5340_TDA3.19), U_XMC4500/TDA4 (H1_TDA4.8 H2_TDA4.8 TDA5340_TDA4.19), U_XMC4500/TDA5 (H1_TDA5.8 H2_TDA5.8 TDA5340_TDA5.19), U_XMC4500/TDA6 (H1_TDA6.8 H2_TDA6.8 TDA5340_TDA6.19)
MOSI: XMC4500 (XMC4500.115), U_XMC4500/TDA1 (H1_TDA1.6 H2_TDA1.6 TDA5340_TDA1.18), U_XMC4500/TDA2 (H1_TDA2.6 H2_TDA2.6 TDA5340_TDA2.18), U_XMC4500/TDA3 (H1_TDA3.6 H2_TDA3.6 TDA5340_TDA3.18), U_XMC4500/TDA4 (H1_TDA4.6 H2_TDA4.6 TDA5340_TDA4.18), U_XMC4500/TDA5 (H1_TDA5.6 H2_TDA5.6 TDA5340_TDA5.18), U_XMC4500/TDA6 (H1_TDA6.6 H2_TDA6.6 TDA5340_TDA6.18)
NCS: XMC4500 (XMC4500.105), U_XMC4500/TDA1 (H1_TDA1.1 H2_TDA1.1 TDA5340_TDA1.16)
NCS: XMC4500 (XMC4500.114), U_XMC4500/TDA2 (H1_TDA2.1 H2_TDA2.1 TDA5340_TDA2.16)
NCS: XMC4500 (XMC4500.118), U_XMC4500/TDA3 (H1_TDA3.1 H2_TDA3.1 TDA5340_TDA3.16)
NCS: XMC4500 (XMC4500.119), U_XMC4500/TDA4 (H1_TDA4.1 H2_TDA4.1 TDA5340_TDA4.16)
NCS: XMC4500 (XMC4500.120), U_XMC4500/TDA5 (H1_TDA5.1 H2_TDA5.1 TDA5340_TDA5.16)
NCS: XMC4500 (XMC4500.121), U_XMC4500/TDA6 (H1_TDA6.1 H2_TDA6.1 TDA5340_TDA6.16)
NetIC3_10: XMC4500 (XMC4500.74), Ethernet (IC3.10)
NetIC3_11: XMC4500 (XMC4500.75), Ethernet (IC3.11 R204.1)
NetIC3_12: XMC4500 (XMC4500.71), Ethernet (IC3.12)
NetIC3_13: XMC4500 (XMC4500.72), Ethernet (IC3.13)
NetIC3_15: XMC4500 (XMC4500.53), Ethernet (IC3.15)
NetIC3_16: XMC4500 (XMC4500.54), Ethernet (IC3.16)
NetIC3_17: XMC4500 (XMC4500.70), Ethernet (IC3.17)
NetIC3_19: XMC4500 (XMC4500.69), Ethernet (IC3.19)
NetIC3_20: XMC4500 (XMC4500.68), Ethernet (IC3.20)
NetIC3_21: XMC4500 (XMC4500.67), Ethernet (IC3.21)
P_ON: XMC4500 (XMC4500.4), U_XMC4500/TDA6 (H1_TDA6.3 H2_TDA6.3 TDA5340_TDA6.13)
P_ON: XMC4500 (XMC4500.14), U_XMC4500/TDA5 (H1_TDA5.3 H2_TDA5.3 TDA5340_TDA5.13)
P_ON: XMC4500 (XMC4500.79), U_XMC4500/TDA3 (H1_TDA3.3 H2_TDA3.3 TDA5340_TDA3.13)
P_ON: XMC4500 (XMC4500.80), U_XMC4500/TDA4 (H1_TDA4.3 H2_TDA4.3 TDA5340_TDA4.13)
P_ON: XMC4500 (XMC4500.113), U_XMC4500/TDA2 (H1_TDA2.3 H2_TDA2.3 TDA5340_TDA2.13)
P_ON: XMC4500 (XMC4500.144), U_XMC4500/TDA1 (H1_TDA1.3 H2_TDA1.3 TDA5340_TDA1.13)
PP0: XMC4500 (XMC4500.1), U_XMC4500/TDA6 (H1_TDA6.9 H2_TDA6.9 TDA5340_TDA6.10)
PP0: XMC4500 (XMC4500.11), U_XMC4500/TDA5 (H1_TDA5.9 H2_TDA5.9 TDA5340_TDA5.10)
PP0: XMC4500 (XMC4500.77), U_XMC4500/TDA3 (H1_TDA3.9 H2_TDA3.9 TDA5340_TDA3.10)
PP0: XMC4500 (XMC4500.83), U_XMC4500/TDA4 (H1_TDA4.9 H2_TDA4.9 TDA5340_TDA4.10)
PP0: XMC4500 (XMC4500.110), U_XMC4500/TDA2 (H1_TDA2.9 H2_TDA2.9 TDA5340_TDA2.10)
PP0: XMC4500 (XMC4500.141), U_XMC4500/TDA1 (H1_TDA1.9 H2_TDA1.9 TDA5340_TDA1.10)
PP1: XMC4500 (XMC4500.2), U_XMC4500/TDA6 (H1_TDA6.7 H2_TDA6.7 TDA5340_TDA6.11)
PP1: XMC4500 (XMC4500.12), U_XMC4500/TDA5 (H1_TDA5.7 H2_TDA5.7 TDA5340_TDA5.11)
PP1: XMC4500 (XMC4500.78), U_XMC4500/TDA3 (H1_TDA3.7 H2_TDA3.7 TDA5340_TDA3.11)
PP1: XMC4500 (XMC4500.82), U_XMC4500/TDA4 (H1_TDA4.7 H2_TDA4.7 TDA5340_TDA4.11)
PP1: XMC4500 (XMC4500.111), U_XMC4500/TDA2 (H1_TDA2.7 H2_TDA2.7 TDA5340_TDA2.11)
PP1: XMC4500 (XMC4500.142), U_XMC4500/TDA1 (H1_TDA1.7 H2_TDA1.7 TDA5340_TDA1.11)
PP2: XMC4500 (XMC4500.3), U_XMC4500/TDA6 (H1_TDA6.5 H2_TDA6.5 TDA5340_TDA6.12)
PP2: XMC4500 (XMC4500.5), U_XMC4500/TDA5 (H1_TDA5.5 H2_TDA5.5 TDA5340_TDA5.12)
PP2: XMC4500 (XMC4500.73), U_XMC4500/TDA4 (H1_TDA4.5 H2_TDA4.5 TDA5340_TDA4.12)
PP2: XMC4500 (XMC4500.76), U_XMC4500/TDA3 (H1_TDA3.5 H2_TDA3.5 TDA5340_TDA3.12)
PP2: XMC4500 (XMC4500.112), U_XMC4500/TDA2 (H1_TDA2.5 H2_TDA2.5 TDA5340_TDA2.12)
PP2: XMC4500 (XMC4500.143), U_XMC4500/TDA1 (H1_TDA1.5 H2_TDA1.5 TDA5340_TDA1.12)
RESET#: XMC4500 (XMC4500.65), Ethernet (D200.1)
SCK: XMC4500 (XMC4500.116), U_XMC4500/TDA1 (H1_TDA1.4 H2_TDA1.4 TDA5340_TDA1.17), U_XMC4500/TDA2 (H1_TDA2.4 H2_TDA2.4 TDA5340_TDA2.17), U_XMC4500/TDA3 (H1_TDA3.4 H2_TDA3.4 TDA5340_TDA3.17), U_XMC4500/TDA4 (H1_TDA4.4 H2_TDA4.4 TDA5340_TDA4.17), U_XMC4500/TDA5 (H1_TDA5.4 H2_TDA5.4 TDA5340_TDA5.17), U_XMC4500/TDA6 (H1_TDA6.4 H2_TDA6.4 TDA5340_TDA6.17)